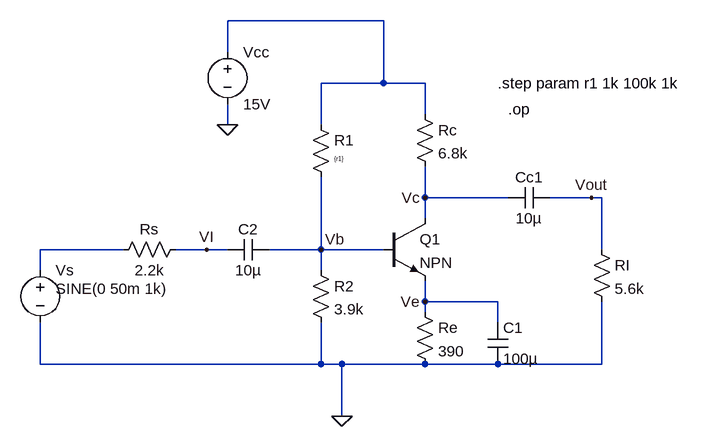
[diagram p0: schematic R1 Calculation.asc]
R1 Calculation.asc, the LTspice schematic file:
Version 4
SHEET 1 880 680
WIRE 176 -192 -64 -192
WIRE -64 -144 -64 -192
WIRE 176 -96 176 -192
WIRE 176 -96 80 -96
WIRE 240 -96 176 -96
WIRE 240 -48 240 -96
WIRE -64 -32 -64 -64
WIRE 80 -32 80 -96
WIRE 240 80 240 32
WIRE 368 80 240 80
WIRE 496 80 432 80
WIRE 512 80 496 80
WIRE 240 112 240 80
WIRE -224 160 -352 160
WIRE -96 160 -144 160
WIRE -64 160 -96 160
WIRE 80 160 80 48
WIRE 80 160 0 160
WIRE 176 160 80 160
WIRE 512 160 512 80
WIRE -352 192 -352 160
WIRE 80 192 80 160
WIRE 240 240 240 208
WIRE 352 240 240 240
WIRE 240 256 240 240
WIRE 352 272 352 240
WIRE -352 336 -352 272
WIRE 80 336 80 272
WIRE 80 336 -352 336
WIRE 112 336 80 336
WIRE 240 336 112 336
WIRE 352 336 240 336
WIRE 512 336 512 240
WIRE 512 336 352 336
WIRE 112 416 112 336
FLAG -64 -32 0
FLAG 112 416 0
FLAG -96 160 VI
FLAG 240 240 Ve
FLAG 240 80 Vc
FLAG 80 160 Vb
FLAG 496 80 Vout
SYMBOL npn 176 112 R0
SYMATTR InstName Q1
SYMBOL cap 368 96 R270
WINDOW 0 32 32 VTop 2
WINDOW 3 0 32 VBottom 2
SYMATTR InstName Cc1
SYMATTR Value 10µ
SYMBOL res 496 144 R0
SYMATTR InstName RI
SYMATTR Value 5.6k
SYMBOL res 224 -64 R0
SYMATTR InstName Rc
SYMATTR Value 6.8k
SYMBOL cap 336 272 R0
SYMATTR InstName C1
SYMATTR Value 100µ
SYMBOL cap 0 144 R90
WINDOW 0 0 32 VBottom 2
WINDOW 3 32 32 VTop 2
SYMATTR InstName C2
SYMATTR Value 10µ
SYMBOL res -128 144 R90
WINDOW 0 0 56 VBottom 2
WINDOW 3 32 56 VTop 2
SYMATTR InstName Rs
SYMATTR Value 2.2k
SYMBOL voltage -64 -160 R0
SYMATTR InstName Vcc
SYMATTR Value 15V
SYMBOL res 64 -48 R0
WINDOW 3 36 68 Left 0
SYMATTR Value {r1}
SYMATTR InstName R1
SYMBOL res 224 240 R0
SYMATTR InstName Re
SYMATTR Value 390
SYMBOL res 64 176 R0
SYMATTR InstName R2
SYMATTR Value 3.9k
SYMBOL voltage -352 176 R0
WINDOW 3 24 44 Left 2
WINDOW 123 0 0 Left 0
WINDOW 39 0 0 Left 0
SYMATTR Value SINE(0 50m 1k)
SYMATTR InstName Vs
TEXT 352 -96 Left 2 !.step param r1 1k 100k 1k
TEXT 368 -56 Left 2 !.op

The netlist it stands for:
* R1 Calculation.asc
Q1 Vc Vb Ve 0 NPN
Cc1 Vc Vout 10µ
RI Vout 0 5.6k
Rc N001 Vc 6.8k
C1 Ve 0 100µ
C2 Vb VI 10µ
Rs VI N002 2.2k
Vcc N001 0 15V
R1 N001 Vb {r1}
Re Ve 0 390
R2 Vb 0 3.9k
Vs N002 0 SINE(0 50m 1k)
.model NPN NPN
.model PNP PNP
.lib standard.bjt
.step param r1 1k 100k 1k
.op
.backanno
.end

* Results of the author's LTspice run, read from the files saved beside the schematic
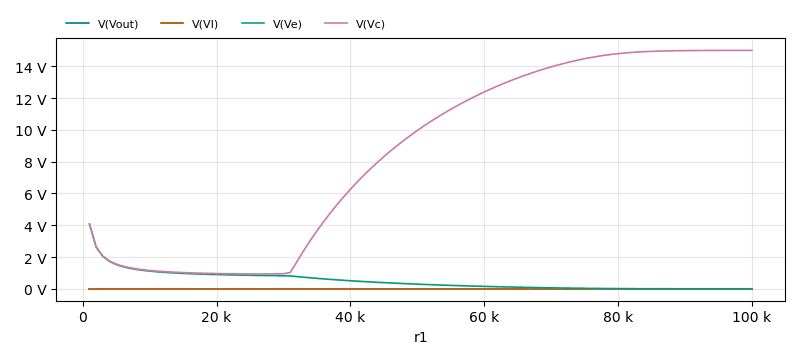
[diagram p1: Operating Point of R1 Calculation.asc, plotted from the saved traces]
* Operating Point, 1 run:
*   V(Vout): 228.9 fV at r1=1 k, 839.9 fV at r1=100 k, min 52.19 fV, max 839.9 fV
*   V(VI): 108.2 fV at r1=1 k, 12.39 fV at r1=100 k, min 12.39 fV, max 108.2 fV
*   V(Ve): 4.067 V at r1=1 k, 111.5 µV at r1=100 k, min 111.5 µV, max 4.067 V
*   V(Vc): 4.087 V at r1=1 k, 15 V at r1=100 k, min 931.9 mV, max 15 V
* From the log:
*   Semiconductor Device Operating Points:
*                           --- Bipolar Transistors ---
*   Name:       q1
*   Model:      npn
*   Ib:       8.82e-03
*   Ic:       1.60e-03
*   Vbe:      8.50e-01
*   Vbc:      8.30e-01
*   Vce:      2.02e-02
*   BetaDC:   1.82e-01
*   Gm:       3.96e-01
*   Rpi:      1.37e+02
*   Rx:       0.00e+00
*   Ro:       3.00e+00
*   Cbe:      0.00e+00
*   Cbc:      0.00e+00
*   Cjs:      0.00e+00
*   BetaAC:   5.43e+01
*   Cbx:      0.00e+00
*   Ft:       0.00e+00